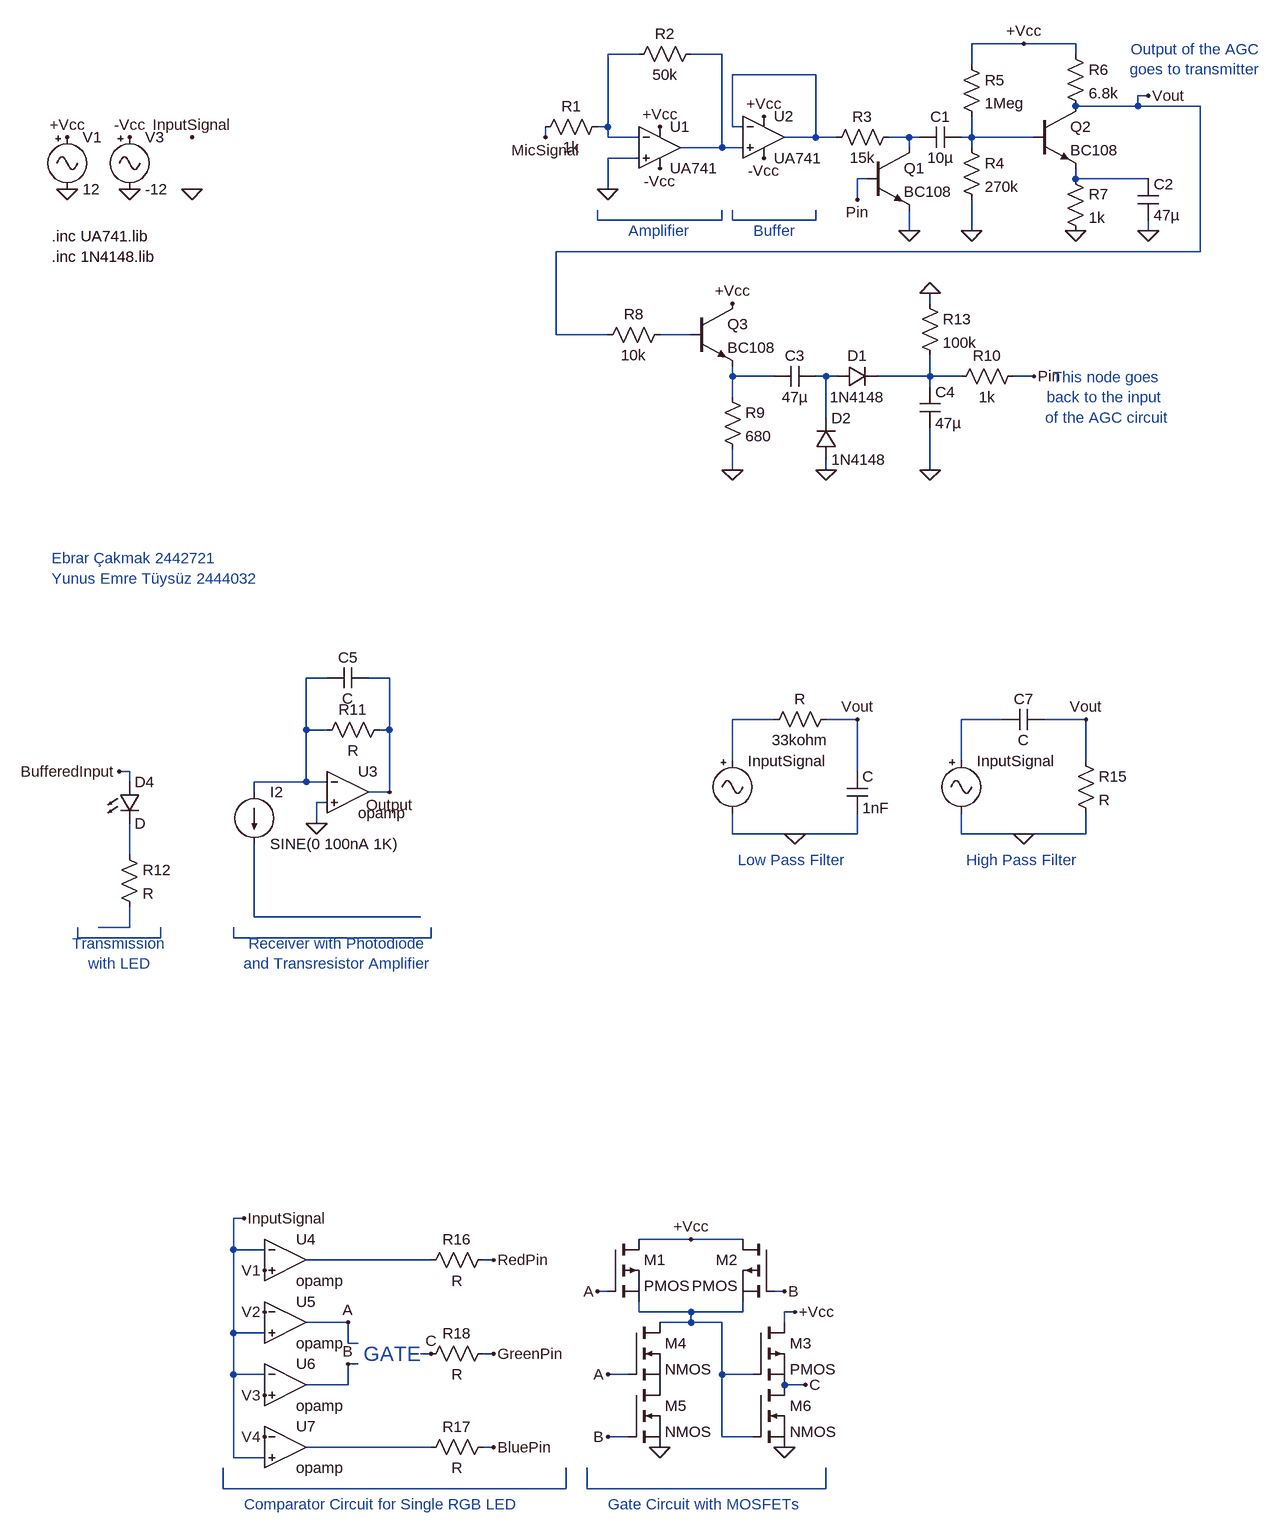
[diagram p0: schematic ltspiceCompleteCircuit.asc]
ltspiceCompleteCircuit.asc, the LTspice schematic file:
Version 4
SHEET 1 3152 2264
WIRE 1360 -16 1280 -16
WIRE 1440 -16 1360 -16
WIRE 768 0 720 0
WIRE 896 0 848 0
WIRE 1440 0 1440 -16
WIRE 1280 16 1280 -16
WIRE 1040 32 912 32
WIRE 1552 64 1536 64
WIRE 1536 80 1536 64
WIRE 1536 80 1440 80
WIRE 1632 80 1536 80
WIRE 720 112 720 0
WIRE 720 112 704 112
WIRE 912 112 912 32
WIRE 928 112 912 112
WIRE 624 128 624 112
WIRE 720 128 720 112
WIRE 768 128 720 128
WIRE 1040 128 1040 32
WIRE 1040 128 992 128
WIRE 1072 128 1040 128
WIRE 1184 128 1152 128
WIRE 1200 128 1184 128
WIRE 1280 128 1280 96
WIRE 1280 128 1264 128
WIRE 1376 128 1280 128
WIRE 896 144 896 0
WIRE 896 144 832 144
WIRE 928 144 896 144
WIRE 1184 144 1184 128
WIRE 1280 144 1280 128
WIRE 768 160 720 160
WIRE 1120 192 1104 192
WIRE 1440 192 1440 176
WIRE 1552 192 1440 192
WIRE 720 208 720 160
WIRE 1104 224 1104 192
WIRE 704 256 704 240
WIRE 896 256 896 240
WIRE 896 256 704 256
WIRE 912 256 912 240
WIRE 1040 256 1040 240
WIRE 1040 256 912 256
WIRE 1184 272 1184 240
WIRE 1280 272 1280 224
WIRE 1552 272 1552 256
WIRE 1632 304 1632 80
WIRE 1632 304 640 304
WIRE 1216 384 1216 368
WIRE 640 432 640 304
WIRE 720 432 640 432
WIRE 848 432 800 432
WIRE 912 496 912 480
WIRE 976 496 912 496
WIRE 1056 496 1040 496
WIRE 1072 496 1056 496
WIRE 1216 496 1216 464
WIRE 1216 496 1136 496
WIRE 1264 496 1216 496
WIRE 1376 496 1344 496
WIRE 1216 512 1216 496
WIRE 912 528 912 496
WIRE 1056 560 1056 496
WIRE 912 640 912 608
WIRE 1056 640 1056 624
WIRE 1216 640 1216 576
WIRE 288 960 256 960
WIRE 384 960 352 960
WIRE 976 1024 912 1024
WIRE 1104 1024 1056 1024
WIRE 1328 1024 1264 1024
WIRE 1456 1024 1392 1024
WIRE 256 1040 256 960
WIRE 288 1040 256 1040
WIRE 384 1040 384 960
WIRE 384 1040 368 1040
WIRE 912 1088 912 1024
WIRE 1264 1088 1264 1024
WIRE 1456 1088 1456 1024
WIRE -16 1104 -32 1104
WIRE 1104 1104 1104 1024
WIRE -16 1120 -16 1104
WIRE 256 1120 256 1040
WIRE 256 1120 176 1120
WIRE 288 1120 256 1120
WIRE 176 1136 176 1120
WIRE 384 1136 384 1040
WIRE 384 1136 352 1136
WIRE 288 1152 272 1152
WIRE 272 1184 272 1152
WIRE 912 1200 912 1168
WIRE 1008 1200 912 1200
WIRE 1104 1200 1104 1168
WIRE 1104 1200 1008 1200
WIRE 1264 1200 1264 1168
WIRE 1360 1200 1264 1200
WIRE 1456 1200 1456 1168
WIRE 1456 1200 1360 1200
WIRE -16 1232 -16 1184
WIRE 176 1328 176 1216
WIRE 432 1328 176 1328
WIRE -16 1344 -16 1312
WIRE -16 1344 -64 1344
WIRE -96 1360 -96 1344
WIRE 32 1360 32 1344
WIRE 32 1360 -96 1360
WIRE 144 1360 144 1344
WIRE 448 1360 448 1344
WIRE 448 1360 144 1360
WIRE 160 1792 144 1792
WIRE 848 1824 768 1824
WIRE 928 1824 848 1824
WIRE 144 1840 144 1792
WIRE 192 1840 144 1840
WIRE 448 1856 256 1856
WIRE 544 1856 528 1856
WIRE 720 1904 704 1904
WIRE 992 1904 976 1904
WIRE 768 1936 768 1920
WIRE 848 1936 768 1936
WIRE 928 1936 928 1920
WIRE 928 1936 848 1936
WIRE 1008 1936 992 1936
WIRE 320 1952 256 1952
WIRE 848 1952 848 1936
WIRE 848 1952 800 1952
WIRE 896 1952 848 1952
WIRE 992 1952 992 1936
WIRE 144 1968 144 1840
WIRE 192 1968 144 1968
WIRE 320 1984 320 1952
WIRE 336 1984 320 1984
WIRE 448 2000 432 2000
WIRE 544 2000 528 2000
WIRE 336 2016 320 2016
WIRE 144 2032 144 1968
WIRE 192 2032 144 2032
WIRE 752 2032 720 2032
WIRE 896 2032 896 1952
WIRE 944 2032 896 2032
WIRE 320 2048 320 2016
WIRE 320 2048 256 2048
WIRE 1024 2048 992 2048
WIRE 752 2128 720 2128
WIRE 896 2128 896 2032
WIRE 944 2128 896 2128
WIRE 448 2144 256 2144
WIRE 544 2144 528 2144
WIRE 144 2160 144 2032
WIRE 192 2160 144 2160
WIRE 128 2208 128 2176
WIRE 656 2208 656 2176
WIRE 656 2208 128 2208
WIRE 688 2208 688 2176
WIRE 1056 2208 1056 2176
WIRE 1056 2208 688 2208
FLAG -112 208 0
FLAG -16 208 0
FLAG 80 208 0
FLAG -112 128 +Vcc
FLAG -16 128 -Vcc
FLAG 80 128 InputSignal
FLAG 624 128 MicSignal
FLAG 800 112 +Vcc
FLAG 800 176 -Vcc
FLAG 720 208 0
FLAG 960 96 +Vcc
FLAG 960 160 -Vcc
FLAG 1184 272 0
FLAG 1280 272 0
FLAG 1360 -16 +Vcc
FLAG 1440 272 0
FLAG 1552 272 0
FLAG 1552 64 Vout
FLAG 912 384 +Vcc
FLAG 1376 496 Pin
FLAG 912 640 0
FLAG 1056 640 0
FLAG 1216 640 0
FLAG 1216 368 0
FLAG -32 1104 BufferedInput
FLAG 272 1184 0
FLAG 384 1136 Output
FLAG 1008 1200 0
FLAG 1360 1200 0
FLAG 1104 1024 Vout
FLAG 1456 1024 Vout
FLAG 192 1872 V1
FLAG 192 1936 V2
FLAG 192 2064 V3
FLAG 192 2128 V4
FLAG 160 1792 InputSignal
FLAG 544 1856 RedPin
FLAG 544 2000 GreenPin
FLAG 544 2144 BluePin
FLAG 320 1952 A
FLAG 320 2016 B
FLAG 448 2000 C
FLAG 704 1904 A
FLAG 992 1904 B
FLAG 720 2032 A
FLAG 720 2128 B
FLAG 800 2144 0
FLAG 992 2144 0
FLAG 1024 2048 C
FLAG 848 1824 +Vcc
FLAG 1008 1936 +Vcc
FLAG 1104 224 Pin
SYMBOL Misc\\signal -112 112 R0
WINDOW 123 0 0 Left 0
WINDOW 39 0 0 Left 0
SYMATTR InstName V1
SYMATTR Value 12
SYMBOL Misc\\signal -16 112 R0
WINDOW 123 0 0 Left 0
WINDOW 39 0 0 Left 0
SYMATTR InstName V3
SYMATTR Value -12
SYMBOL res 720 96 R90
WINDOW 0 0 56 VBottom 2
WINDOW 3 32 56 VTop 2
SYMATTR InstName R1
SYMATTR Value 1k
SYMBOL res 864 -16 R90
WINDOW 0 0 56 VBottom 2
WINDOW 3 32 56 VTop 2
SYMATTR InstName R2
SYMATTR Value 50k
SYMBOL OpAmps\\opamp2 800 80 R0
SYMATTR InstName U1
SYMATTR Value UA741
SYMBOL OpAmps\\opamp2 960 64 R0
SYMATTR InstName U2
SYMATTR Value UA741
SYMBOL res 1168 112 R90
WINDOW 0 0 56 VBottom 2
WINDOW 3 32 56 VTop 2
SYMATTR InstName R3
SYMATTR Value 15k
SYMBOL npn 1120 144 R0
SYMATTR InstName Q1
SYMATTR Value BC108
SYMBOL cap 1264 112 R90
WINDOW 0 0 32 VBottom 2
WINDOW 3 32 32 VTop 2
SYMATTR InstName C1
SYMATTR Value 10µ
SYMBOL res 1264 128 R0
SYMATTR InstName R4
SYMATTR Value 270k
SYMBOL res 1264 0 R0
SYMATTR InstName R5
SYMATTR Value 1Meg
SYMBOL res 1424 -16 R0
SYMATTR InstName R6
SYMATTR Value 6.8k
SYMBOL npn 1376 80 R0
SYMATTR InstName Q2
SYMATTR Value BC108
SYMBOL res 1424 176 R0
SYMATTR InstName R7
SYMATTR Value 1k
SYMBOL cap 1536 192 R0
SYMATTR InstName C2
SYMATTR Value 47µ
SYMBOL res 816 416 R90
WINDOW 0 0 56 VBottom 2
WINDOW 3 32 56 VTop 2
SYMATTR InstName R8
SYMATTR Value 10k
SYMBOL npn 848 384 R0
SYMATTR InstName Q3
SYMATTR Value BC108
SYMBOL res 896 512 R0
SYMATTR InstName R9
SYMATTR Value 680
SYMBOL cap 1040 480 R90
WINDOW 0 0 32 VBottom 2
WINDOW 3 32 32 VTop 2
SYMATTR InstName C3
SYMATTR Value 47µ
SYMBOL cap 1200 512 R0
SYMATTR InstName C4
SYMATTR Value 47µ
SYMBOL res 1360 480 R90
WINDOW 0 0 56 VBottom 2
WINDOW 3 32 56 VTop 2
SYMATTR InstName R10
SYMATTR Value 1k
SYMBOL diode 1072 512 R270
WINDOW 0 32 32 VTop 2
WINDOW 3 0 32 VBottom 2
SYMATTR InstName D1
SYMATTR Value 1N4148
SYMBOL diode 1040 624 M180
WINDOW 0 24 64 Left 2
WINDOW 3 24 0 Left 2
SYMATTR InstName D2
SYMATTR Value 1N4148
SYMBOL res 1200 368 R0
SYMATTR InstName R13
SYMATTR Value 100k
SYMBOL LED -32 1120 R0
SYMATTR InstName D4
SYMBOL res -32 1216 R0
SYMATTR InstName R12
SYMBOL current 176 1136 R0
WINDOW 123 0 0 Left 0
WINDOW 39 0 0 Left 0
SYMATTR InstName I2
SYMATTR Value SINE(0 100nA 1K)
SYMBOL OpAmps\\opamp 320 1072 R0
SYMATTR InstName U3
SYMBOL res 384 1024 R90
WINDOW 0 0 56 VBottom 2
WINDOW 3 32 56 VTop 2
SYMATTR InstName R11
SYMBOL cap 352 944 R90
WINDOW 0 0 32 VBottom 2
WINDOW 3 32 32 VTop 2
SYMATTR InstName C5
SYMBOL res 1072 1008 R90
WINDOW 0 0 56 VBottom 2
WINDOW 3 32 56 VTop 2
SYMATTR InstName R
SYMATTR Value 33kohm
SYMBOL cap 1088 1104 R0
SYMATTR InstName C
SYMATTR Value 1nF
SYMBOL cap 1392 1008 R90
WINDOW 0 0 32 VBottom 2
WINDOW 3 32 32 VTop 2
SYMATTR InstName C7
SYMBOL res 1440 1072 R0
SYMATTR InstName R15
SYMBOL Misc\\signal 912 1072 R0
WINDOW 123 0 0 Left 0
WINDOW 39 0 0 Left 0
SYMATTR InstName InputSignal
SYMATTR Value ""
SYMBOL Misc\\signal 1264 1072 R0
WINDOW 123 0 0 Left 0
WINDOW 39 0 0 Left 0
SYMATTR InstName InputSignal
SYMATTR Value ""
SYMBOL OpAmps\\opamp 224 1792 R0
SYMATTR InstName U4
SYMBOL OpAmps\\opamp 224 1888 R0
SYMATTR InstName U5
SYMBOL OpAmps\\opamp 224 1984 R0
SYMATTR InstName U6
SYMBOL OpAmps\\opamp 224 2080 R0
SYMATTR InstName U7
SYMBOL res 544 1840 R90
WINDOW 0 0 56 VBottom 2
WINDOW 3 32 56 VTop 2
SYMATTR InstName R16
SYMBOL res 544 2128 R90
WINDOW 0 0 56 VBottom 2
WINDOW 3 32 56 VTop 2
SYMATTR InstName R17
SYMBOL res 544 1984 R90
WINDOW 0 0 56 VBottom 2
WINDOW 3 32 56 VTop 2
SYMATTR InstName R18
SYMBOL pmos 720 1824 R0
SYMATTR InstName M1
SYMBOL pmos 976 1824 M0
SYMATTR InstName M2
SYMBOL pmos 944 1952 R0
SYMATTR InstName M3
SYMBOL nmos 752 1952 R0
SYMATTR InstName M4
SYMBOL nmos 752 2048 R0
SYMATTR InstName M5
SYMBOL nmos 944 2048 R0
SYMATTR InstName M6
TEXT -136 280 Left 2 !.inc UA741.lib
TEXT -136 312 Left 2 !.inc 1N4148.lib
TEXT 752 272 Left 2 ;Amplifier
TEXT 944 272 Left 2 ;Buffer
TEXT 1624 8 Center 2 ;Output of the AGC\ngoes to transmitter
TEXT 1488 528 Center 2 ;This node goes\nback to the input \nof the AGC circuit
TEXT -136 776 Left 2 ;Ebrar Çakmak 2442721\nYunus Emre Tüysüz 2444032
TEXT -32 1384 Center 2 ;Transmission\nwith LED
TEXT 304 1384 Center 2 ;Receiver with Photodiode\nand Transresistor Amplifier
TEXT 1272 1240 Left 2 ;High Pass Filter
TEXT 920 1240 Left 2 ;Low Pass Filter
TEXT 344 2000 Left 3 ;GATE
TEXT 720 2232 Left 2 ;Gate Circuit with MOSFETs
TEXT 160 2232 Left 2 ;Comparator Circuit for Single RGB LED

The netlist it stands for:
* ltspiceCompleteCircuit.asc
V1 +Vcc 0 12
V3 -Vcc 0 -12
R1 N001 MicSignal 1k
R2 N002 N001 50k
XU1 0 N001 +Vcc -Vcc N002 UA741  ; pins In+ In- V+ V- OUT
XU2 N002 N003 +Vcc -Vcc N003 UA741  ; pins In+ In- V+ V- OUT
R3 N004 N003 15k
Q1 N004 Pin 0 0 BC108
C1 N005 N004 10µ
R4 N005 0 270k
R5 +Vcc N005 1Meg
R6 +Vcc Vout 6.8k
Q2 Vout N005 N006 0 BC108
R7 N006 0 1k
C2 N006 0 47µ
R8 N009 Vout 10k
Q3 +Vcc N009 N010 0 BC108
R9 N010 0 680
C3 N011 N010 47µ
C4 N012 0 47µ
R10 Pin N012 1k
D1 N011 N012 1N4148
D2 0 N011 1N4148
R13 0 N012 100k
D4 BufferedInput N016 D
R12 N016 N018 R
I2 N013 N017 SINE(0 100nA 1K)
XU3 N013 0 Output opamp Aol=100K GBW=10Meg  ; pins invin noninvin out
R11 Output N013 R
C5 Output N013 C
R Vout N014 33kohm
C Vout 0 1nF
C7 Vout N015 C
R15 Vout 0 R
V§InputSignal N014 0
V§InputSignal N015 0
XU4 InputSignal V1 N021 opamp Aol=100K GBW=10Meg  ; pins invin noninvin out
XU5 V2 InputSignal A opamp Aol=100K GBW=10Meg  ; pins invin noninvin out
XU6 InputSignal V3 B opamp Aol=100K GBW=10Meg  ; pins invin noninvin out
XU7 V4 InputSignal N023 opamp Aol=100K GBW=10Meg  ; pins invin noninvin out
R16 RedPin N021 R
R17 BluePin N023 R
R18 GreenPin C R
M1 +Vcc A N022 N022 PMOS
M2 +Vcc B N022 N022 PMOS
M3 +Vcc N022 C C PMOS
M4 N022 A P001 P001 NMOS
M5 P001 B 0 0 NMOS
M6 C N022 0 0 NMOS
.model D D
.lib standard.dio
.model NPN NPN
.model PNP PNP
.lib standard.bjt
.model NMOS NMOS
.model PMOS PMOS
.lib standard.mos
.inc UA741.lib
.inc 1N4148.lib
* Amplifier
* Buffer
* Output of the AGC
* goes to transmitter
* This node goes
* back to the input
* of the AGC circuit
* Ebrar Çakmak 2442721
* Yunus Emre Tüysüz 2444032
* Transmission
* with LED
* Receiver with Photodiode
* and Transresistor Amplifier
* High Pass Filter
* Low Pass Filter
* GATE
* Gate Circuit with MOSFETs
* Comparator Circuit for Single RGB LED
.backanno
.end